# EAGLE design Interface_CoVASPSy_v1re2 (EAGLE 9.6.2)
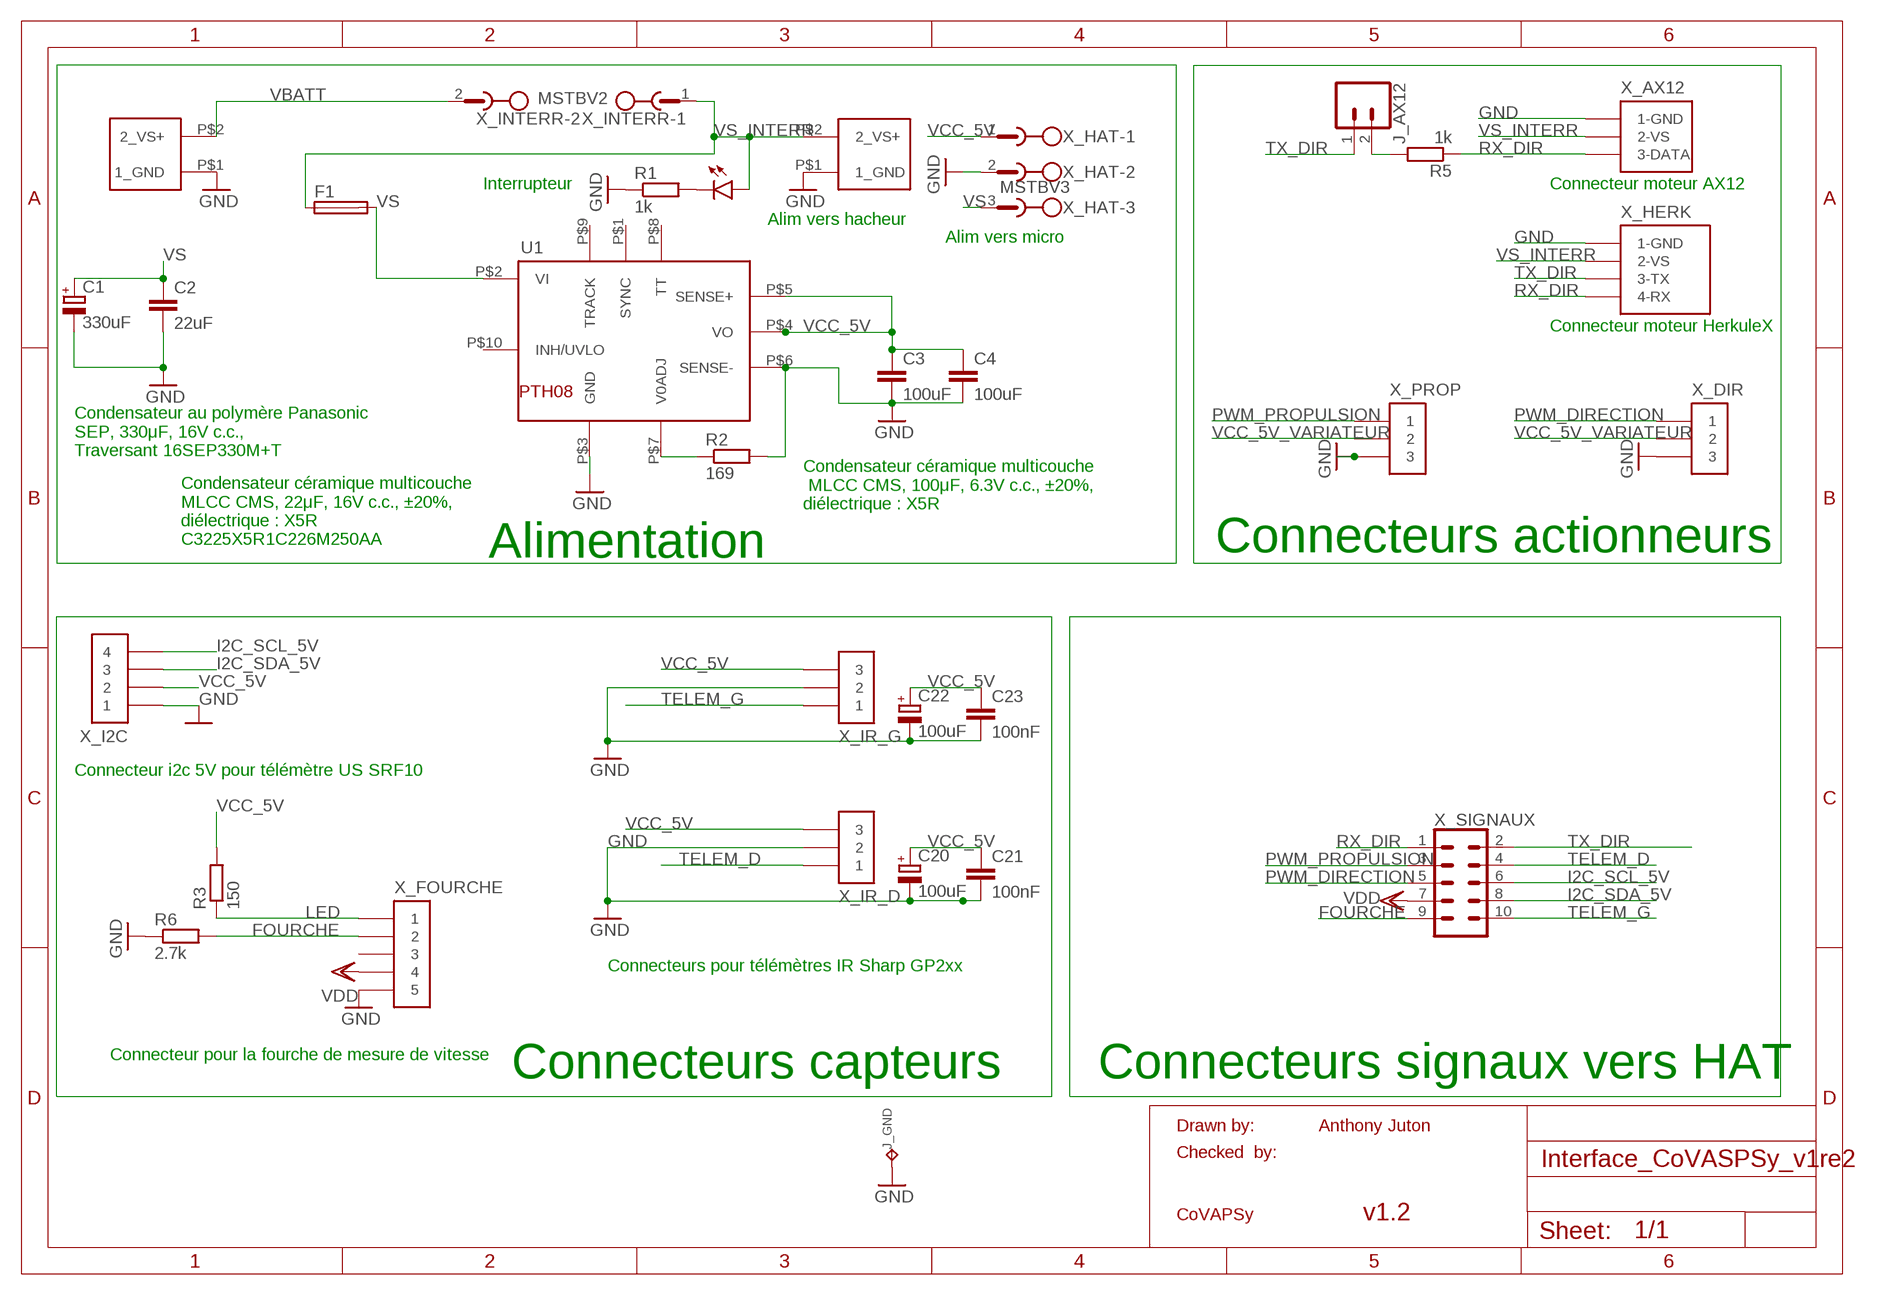
[diagram p0: schematic, sheet 1]

## Parts
C1  330uF  CPOL-EUE3.5-10  [E3,5-10]
C2  22uF  C-EUC1210  [C1210]
C3  100uF  C-EUC1206K  [C1206K]
C4  100uF  C-EUC1206K  [C1206K]
C20  100uF  CPOL-EUA/3216-18W  [A/3216-18W]
C21  100nF  C-EUC1206  [C1206]
C22  100uF  CPOL-EUA/3216-18W  [A/3216-18W]
C23  100nF  C-EUC1206  [C1206]
F1  SH22,5  [SH22,5]
J_AX12  CONN_02  [1X02]
J_GND  COSSE_POIGN  [COSSE_POIGNARD]
LED1  LEDSML1206  [SML1206]
R1  1k  R-EU_M1206  [M1206]
R2  169  R-EU_R0805  [R0805]
R3  150  R-EU_M1206  [M1206]
R5  1k  R-EU_M1206  [M1206]
R6  2.7k  R-EU_M1206  [M1206]
U1  CONV_TI_PTH08  [CONV_TI_PTH8]
X_AX12  MOLEX_AX12  [MOLEX_AX12]
X_BATT  CONN_ALIM_TROU  [CONN_ALIM_TROU]
X_DIR  CAVALIER_3  [CAVALIER_3]
X_FOURCHE  MOLEX_5_DROIT  [MOLEX_5_DROIT]
X_HACH  CONN_ALIM_TROU  [CONN_ALIM_TROU]
X_HAT  MSTBV3  [MSTBV3]
X_HERK  TE_HERKULEX  [TE_HERKULEX]
X_I2C  MOLEX_4_DROIT  [MOLEX_4_DROIT]
X_INTERR  MSTBV2  [MSTBV2]
X_IR_D  JST_3  [JST_3]
X_IR_G  JST_3  [JST_3]
X_PROP  CAVALIER_3  [CAVALIER_3]
X_SIGNAUX  CONN_05X2SHD  [2X5-SHROUDED]

## Nets
FOURCHE: R6.2 X_FOURCHE.P$2 X_SIGNAUX.9
GND: C1.- C2.2 C3.2 C4.2 C20.- C21.2 C22.- C23.2 J_GND.P$1 R1.1 R2.2 R6.1 U1.P$3(GND) U1.P$6(SENSE-) X_AX12.P$1(1-GND) X_BATT.P$1(1_GND) X_DIR.P$3 X_FOURCHE.P$5 X_HACH.P$1(1_GND) X_HAT.2 X_HERK.P$1(1-GND) X_I2C.P$1 X_IR_D.P$2 X_IR_G.P$2 X_PROP.P$3
I2C_SCL_5V: X_I2C.P$4 X_SIGNAUX.6
I2C_SDA_5V: X_I2C.P$3 X_SIGNAUX.8
LED: R3.1 X_FOURCHE.P$1
N$1: LED1.C R1.2
N$4: J_AX12.2 R5.2
N$11: R2.1 U1.P$7(V0ADJ)
PWM_DIRECTION: X_DIR.P$1 X_SIGNAUX.5
PWM_PROPULSION: X_PROP.P$1 X_SIGNAUX.3
RX_DIR: R5.1 X_AX12.P$3(3-DATA) X_HERK.P$4(4-RX) X_SIGNAUX.1
TELEM_D: X_IR_D.P$1 X_SIGNAUX.4
TELEM_G: X_IR_G.P$1 X_SIGNAUX.10
TX_DIR: J_AX12.1 X_HERK.P$3(3-TX) X_SIGNAUX.2
VBATT: X_BATT.P$2(2_VS+) X_INTERR.2
VCC_5V: C3.1 C4.1 C20.+ C21.1 C22.+ C23.1 R3.2 U1.P$4(VO) U1.P$5(SENSE+) X_HAT.1 X_I2C.P$2 X_IR_D.P$3 X_IR_G.P$3
VCC_5V_VARIATEUR: X_DIR.P$2 X_PROP.P$2
VDD: X_FOURCHE.P$4 X_SIGNAUX.7
VS: C1.+ C2.1 F1.2 U1.P$2(VI) X_HAT.3
VS_INTERR: F1.1 LED1.A X_AX12.P$2(2-VS) X_HACH.P$2(2_VS+) X_HERK.P$2(2-VS) X_INTERR.1
Unconnected: U1.P$1(SYNC) U1.P$8(TT) U1.P$9(TRACK) U1.P$10(INH/UVLO) X_FOURCHE.P$3

## Notes on the sheet
- Interrupteur | Connecteur moteur AX12
- Alim vers hacheur
- Alim vers micro
- Connecteur moteur HerkuleX
- Condensateur au polymère Panasonic 
  SEP, 330μF, 16V c.c., 
  Traversant 16SEP330M+T
- Condensateur céramique multicouche
   MLCC CMS, 100μF, 6.3V c.c., ±20%, 
  diélectrique : X5R
- Condensateur céramique multicouche
  MLCC CMS, 22μF, 16V c.c., ±20%,
  diélectrique : X5R
  C3225X5R1C226M250AA
- Alimentation | Connecteurs actionneurs
- Connecteur i2c 5V pour télémètre US SRF10
- Connecteurs pour télémètres IR Sharp GP2xx
- Connecteur pour la fourche de mesure de vitesse
- Connecteurs capteurs | Connecteurs signaux vers HAT
- Drawn by: | Anthony Juton
- Checked  by:
- CoVAPSy | v1.2

## Library data of the parts
C1 = rcl:CPOL-EU: POLARIZED CAPACITOR, European symbol; SPICEPREFIX: C
C2 = rcl:C-EU: CAPACITOR, European symbol; SPICEPREFIX: C
C3 C4 C21 C23 = rcl:C-EU: CAPACITOR, European symbol
C20 C22 = rcl:CPOL-EU: POLARIZED CAPACITOR, European symbol
F1 = fuse:SH22,5: FUSE HOLDER grid 22,5 mm, OGN0031 8201, Schurter (Buerklin); MF: SCHURTER; MPN: 0031.8201; OC_FARNELL: 1162740; OC_NEWARK: 96F8317
J_AX12 = SparkFun-Connectors:CONN_02: Multi connection point. Often used as Generic Header-pin footprint for 0.1 inch spaced/style header connections On any of the 0.1 inch spaced packages, you can populate with these: Break Away Headers - Straight <https://www.sparkfun.com/products/116> (PRT-00116) Break Away Male Headers - Right Angle <https://www.sparkfun.com/products/553> (PRT-00553) Female Headers <https://www.sparkfun.com/products/115> (PRT-00115) Break Away Headers - Machine Pin <https://www.sparkfun.com/products/117> (PRT-00117) Break Away Female Headers - Swiss Machine Pin <https://www.sparkfun.com/products/743> (PRT-00743) For SCREWTERMINALS and SPRING TERMINALS visit here: Screw Terimnals on SparkFun.com <https://www.sparkfun.com/search/results?term=Screw+Terminals> (5mm/3.5mm/2.54mm spacing) This device is also useful as a general connection point to wire up your design to another part of your project. Our various solder wires solder well into these plated through hole pads. Hook-Up Wire - Assortment (Stranded, 22 AWG) <https://www.sparkfun.com/products/11375> (PRT-11375) Hook-Up Wire - Assortment (Solid Core, 22 AWG) <https://www.sparkfun.com/products/11367> (PRT-11367) View the entire wire category on our website here <https://www.sparkfun.com/categories/141> Special notes: Molex polarized connector foot print use with: PRT-08233 with associated crimp pins and housings. 2.54_SCREWTERM for use with PRT-10571. 3.5mm Screw Terminal footprints for PRT-08084 5mm Screw Terminal footprints for use with PRT-08432
J_GND = lib_ens_aj_v1:COSSE_POIGN
LED1 = led:LED: LED OSRAM: - CHIPLED LG R971, LG N971, LY N971, LG Q971, LY Q971, LO R971, LY R971 LH N974, LH R974 LS Q976, LO Q976, LY Q976 LO Q996 - Hyper CHIPLED LW Q18S LB Q993, LB Q99A, LB R99A - SideLED LS A670, LO A670, LY A670, LG A670, LP A670 LB A673, LV A673, LT A673, LW A673 LH A674 LY A675 LS A676, LA A676, LO A676, LY A676, LW A676 LS A679, LY A679, LG A679 - Hyper Micro SIDELED® LS Y876, LA Y876, LO Y876, LY Y876 LT Y87S - SmartLED LW L88C, LW L88S LB L89C, LB L89S, LG L890 LS L89K, LO L89K, LY L89K LS L896, LA L896, LO L896, LY L896 - TOPLED LS T670, LO T670, LY T670, LG T670, LP T670 LSG T670, LSP T670, LSY T670, LOP T670, LYG T670 LG T671, LOG T671, LSG T671 LB T673, LV T673, LT T673, LW T673 LH T674 LS T676, LA T676, LO T676, LY T676, LB T676, LH T676, LSB T676, LW T676 LB T67C, LV T67C, LT T67C, LS T67K, LO T67K, LY T67K, LW E67C LS E67B, LA E67B, LO E67B, LY E67B, LB E67C, LV E67C, LT E67C LW T67C LS T679, LY T679, LG T679 LS T770, LO T770, LY T770, LG T770, LP T770 LB T773, LV T773, LT T773, LW T773 LH T774 LS E675, LA E675, LY E675, LS T675 LS T776, LA T776, LO T776, LY T776, LB T776 LHGB T686 LT T68C, LB T68C - Hyper Mini TOPLED® LB M676 - Mini TOPLED Santana® LG M470 LS M47K, LO M47K, LY M47K Source: http://www.osram.convergy.de LUXEON: - LUMILED® LXK2-PW12-R00, LXK2-PW12-S00, LXK2-PW14-U00, LXK2-PW14-V00 LXK2-PM12-R00, LXK2-PM12-S00, LXK2-PM14-U00 LXK2-PE12-Q00, LXK2-PE12-R00, LXK2-PE12-S00, LXK2-PE14-T00, LXK2-PE14-U00 LXK2-PB12-K00, LXK2-PB12-L00, LXK2-PB12-M00, LXK2-PB14-N00, LXK2-PB14-P00, LXK2-PB14-Q00 LXK2-PR12-L00, LXK2-PR12-M00, LXK2-PR14-Q00, LXK2-PR14-R00 LXK2-PD12-Q00, LXK2-PD12-R00, LXK2-PD12-S00 LXK2-PH12-R00, LXK2-PH12-S00 LXK2-PL12-P00, LXK2-PL12-Q00, LXK2-PL12-R00 Source: www.luxeon.com KINGBRIGHT: KA-3528ASYC Source: www.kingbright.com
R1-R3 R6 = rcl:R-EU_: RESISTOR, European symbol; SPICEPREFIX: R
R5 = rcl:R-EU_: RESISTOR, European symbol
U1 = lib_ens_aj_v1:CONV_TI_PTH08
X_AX12 = lib_ens_aj_v1:MOLEX_AX12
X_BATT X_HACH = lib_ens_aj_v1:CONN_ALIM_TROU
X_DIR X_PROP = lib_ens_aj_v1:CAVALIER_3
X_FOURCHE = lib_ens_aj_v1:MOLEX_5_DROIT
X_HAT = con-phoenix-508:MSTBV3: PHOENIX; MPN: MSTBV 2,5/3-GF-5.08; OC_FARNELL: 1792793; OC_NEWARK: 69R9846
X_HERK = lib_ens_aj_v1:TE_HERKULEX
X_I2C = lib_ens_aj_v1:MOLEX_4_DROIT
X_INTERR = con-phoenix-508:MSTBV2: PHOENIX; MPN: MSTBV 2,5/2-GF-5.08; OC_FARNELL: 1792792; OC_NEWARK: 69R9845
X_IR_D X_IR_G = lib_ens_aj_v1:JST_3
X_SIGNAUX = SparkFun-Connectors:CONN_05X2: Multi connection point. Often used as Generic Header-pin footprint for 0.1 inch spaced/style header connections For AVR SPI programming port, see special device with nice symbol: "AVR_SPI_PROG_5x2.dev" You can populate with any combo of single row headers, but if you'd like an exact match, check these: 2x5 AVR ICSP Male Header <https://www.sparkfun.com/products/778> (PRT-00778) 2x5 Pin Shrouded Header <https://www.sparkfun.com/products/8506> (PRT-08506) On any of the 0.1 inch spaced packages, you can populate with these: Break Away Headers - Straight <https://www.sparkfun.com/products/116> (PRT-00116) Break Away Male Headers - Right Angle <https://www.sparkfun.com/products/553> (PRT-00553) Female Headers <https://www.sparkfun.com/products/115> (PRT-00115) Break Away Headers - Machine Pin <https://www.sparkfun.com/products/117> (PRT-00117) Break Away Female Headers - Swiss Machine Pin <https://www.sparkfun.com/products/743> (PRT-00743) Special note: the shrouded connector mates well with our 5x2 ribbon cables: 2x5 Pin IDC Ribbon Cable <https://www.sparkfun.com/products/8535> (PRT-08535); PROD_ID: CONN-08671; SF_ID: PRT-08506

## Net classes
0 default: width 0.4 mm, drill 0.6 mm, clearance 0.3 mm

## Board
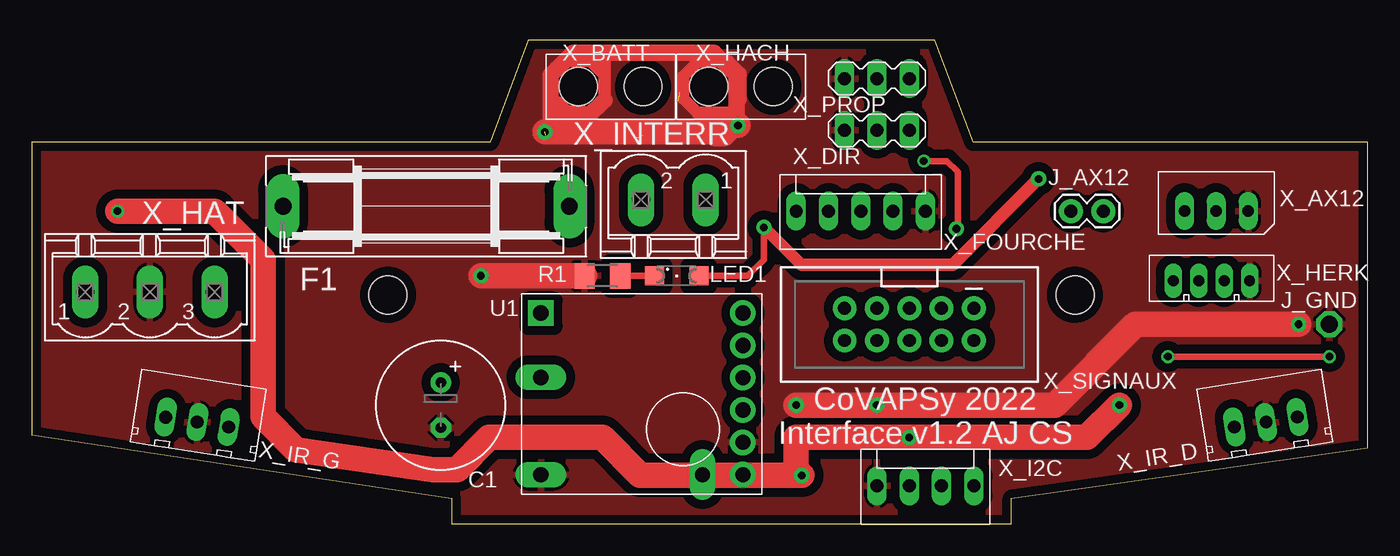
[diagram p1: board, top side]
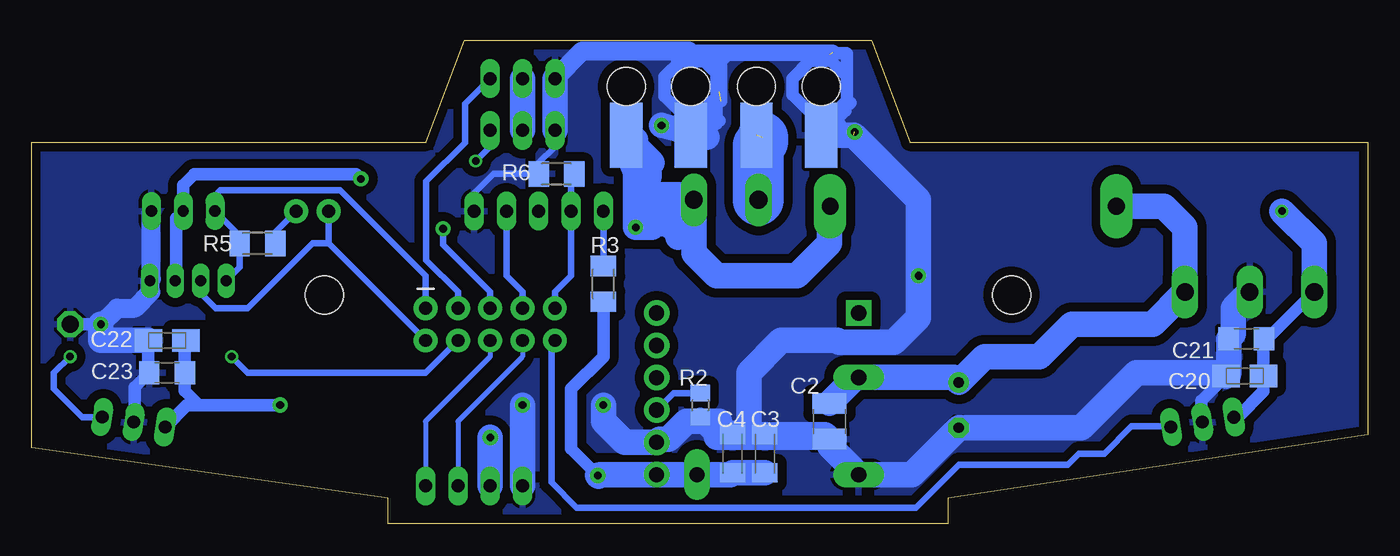
[diagram p2: board, bottom side, seen from below]

Size 105 x 38 mm. Coordinates in mm from the lower left corner, seen from the top.
Outline: 71,38 39,38 36,30 0,30 0,7 33,2 33,0 77,0 77,2 105,6 105,30 74,30 71,38
Copper layers (1*16): Top 0.035mm / dielectric 1.5mm / Bottom 0.035mm
Design rules "default *": minimum track width 6mil, minimum drill 0.35mm, track to track 6mil, track to pad 6mil, pad to pad 6mil, via to via 6mil, smd to smd 6mil, copper to edge 6mil, drill to drill 6mil, minimum pad ring 10mil, minimum via ring 8mil, stop-mask expansion 4mil, vias tented up to drill 0mil, thermal gap 10mil
Holes 3 mm at 82,18 28,18

### Footprints (pad centres in the part's own frame; a part is rotated, then mirrored left to right if it is on the bottom)
E3,5-10 = drill 0.813 pad 1.6: + -1.778,0 | drill 0.813 pad 1.6 octagon: - 1.778,0
C1210 = smd 1.6 x 2.7: 1 -1.4,0; 2 1.4,0
C1206K = smd 1.5 x 2: 1 -1.5,0; 2 1.5,0
A/3216-18W = smd 2.15 x 1.8: + 1.475,0; - -1.475,0
C1206 = smd 1.6 x 1.8: 1 -1.4,0; 2 1.4,0
SH22,5 = drill 1.321 pad 2.54 long: 1 -11.252,0; 2 11.252,0
1X02 = drill 1.016 pad 1.88: 1 0,0; 2 2.54,0
COSSE_POIGNARD = drill 1.35 octagon: P$1 0,0
SML1206 = smd 1.5 x 1.5: A 1.75,0; C -1.75,0
M1206 = smd 1.6 x 2: 1 -1.4,0; 2 1.4,0
R0805 = smd 1.3 x 1.5: 1 -0.95,0; 2 0.95,0
CONV_TI_PTH8 = drill 1.2 pad 2 square: P$1 1.52,14.22 | drill 1.2 pad 2 long: P$2 1.52,9.16; P$3 1.52,1.52; P$4 14.22,1.52 | drill 1.2 pad 2: P$5 17.4,1.52; P$6 17.4,4.06; P$7 17.4,6.6; P$8 17.4,9.14; P$9 17.4,11.68; P$10 17.4,14.22
MOLEX_AX12 = drill 0.9 pad 1.5 long: P$1 -2.5,0; P$2 0,0; P$3 2.5,0
CONN_ALIM_TROU = smd 2.54 x 5.08 bottom: P$1 -2.54,-3.81; P$2 2.54,-3.81 | hole 3: -2.54,0; 2.54,0
CAVALIER_3 = drill 1.016 pad 1.5 long: P$1 -2.54,0; P$2 0,0; P$3 2.54,0
MOLEX_5_DROIT = drill 1.016 pad 1.5 long: P$1 -2.54,0; P$2 0,0; P$3 2.54,0; P$4 5.08,0; P$5 7.62,0
MSTBV3 = drill 1.397 long: 1 -5.08,0; 2 0,0; 3 5.08,0
TE_HERKULEX = drill 0.85 pad 1.3 long: P$1 -3,0; P$2 -1,0; P$3 1,0; P$4 3,0
MOLEX_4_DROIT = drill 1.016 pad 1.5 long: P$1 -2.54,0; P$2 0,0; P$3 2.54,0; P$4 5.08,0
MSTBV2 = drill 1.397 long: 1 -2.54,0; 2 2.54,0
JST_3 = drill 1 pad 1.5 long: P$1 -2.5,0; P$2 0,0 | drill 1.016 pad 1.5 long: P$3 2.5,0
2X5-SHROUDED = drill 1.016 pad 1.88: 1 -1.27,5.08; 2 1.27,5.08; 3 -1.27,2.54; 4 1.27,2.54; 5 -1.27,0; 6 1.27,0; 7 -1.27,-2.54; 8 1.27,-2.54; 9 -1.27,-5.08; 10 1.27,-5.08

### Placement (x,y rotation side)
C1  32.14,9.33 270 top
C2  42.3,8.06 270 bottom
C3  47.38,5.52 90 bottom
C4  49.92,5.52 90 bottom
C20  9.66,11.62 0 bottom
C21  9.53,14.54 180 bottom
C22  94.37,14.41 0 bottom
C23  94.37,11.87 180 bottom
F1  31,24.95 180 top
J_AX12  81.67,24.57 0 top
J_GND  101.99,15.68 0 top
LED1  50.68,19.49 0 top
R1  44.84,19.49 0 top
R2  52.46,9.33 270 bottom
R3  60.08,18.86 270 bottom
R5  87.26,22.03 0 bottom
R6  63.76,27.49 0 bottom
U1  38.49,2.34 0 top
X_AX12  93.1,24.57 180 top
X_BATT  45.5,34.35 0 top
X_DIR  66.43,30.92 180 top
X_FOURCHE  62.62,24.57 0 top
X_HACH  55.74,34.35 0 top
X_HAT  9.28,18.22 0 top
X_HERK  92.72,19.11 180 top
X_I2C  68.97,2.98 0 top
X_INTERR  50.43,25.46 180 top
X_IR_D  97,8 189 top
X_IR_G  13,8 171 top
X_PROP  66.43,34.98 180 top
X_SIGNAUX  68.97,15.68 270 top

### Tracks (layer width: path | path; a pad name or v marks a point on that pad's centre or on a via)
FOURCHE
  Bottom 0.5: R6.2 62.62,27.23 X_FOURCHE.P$2 62.62,19.49 63.89,18.22 X_SIGNAUX.9
GND  (via drill 0.6 pad 1.2)  (3 unrouted)
  Top 1: 55.38,31.43 v55.51,31.3 | 45.01,35.24 45.01,36.99 47.52,36.99 | 45.01,35.24 45.01,33.3 | 41.28,35.75 41.92,36.38 43.86,36.38 45.01,35.24 | 42.11,32.38 42.47,32.02 43.73,32.02 43.38,32.38 42.11,32.38 | 42.11,32.38 41.41,33.08 | 40.78,32.19 41.54,32.19 41.66,32.06 | 55.38,32.32 52.32,32.32 51.2,33.44 51.2,35.13 52.41,36.35 54.74,36.35 55.71,35.39 55.71,33.31 55.24,32.84
  Top 1.3: v40.33,30.8 40.78,31.24 40.78,32.19 40.78,35.24 41.28,35.75 42.55,37.02 53.6,37.02 55.38,35.24 55.38,32.32 55.38,31.43 | 53.86,31.05 53.6,30.79 | 42.51,30.8 43.73,32.02 45.01,33.3
  Top 2: v60.08,9.33 v66.43,9.33 80.4,9.33 86.75,15.68 v99.58,15.68 | v35.31,19.49 R1.1 | v40.33,30.8 42.51,30.8 53.6,30.8 53.6,30.79 53.73,30.67 54.37,30.67 55,31.3 v55.51,31.3
  Bottom 0.5: X_FOURCHE.P$5 70.37,24.7 70.37,25.84 68.72,27.49 R6.1 65.16,28.38 63.89,29.65 X_DIR.P$3
  Bottom 1: C22.- 95.84,11.95 C23.2 96.91,10.73 96.91,8.09 X_IR_D.P$2 | X_BATT.P$1 41.54,31.48 42.27,32.22 41.99,32.22 40.93,33.28 40.93,35.14 | X_BATT.P$1 41.03,31.05 | X_HACH.P$1 50.94,31.68 | 50.96,33.94 50.96,34.56 | X_HACH.P$1 52.78,32.38 | X_HACH.P$1 52.71,32.32 53.98,32.32 55.25,33.59 55.25,35.13 54.03,36.35 52.89,36.35 | 53.35,37.16 53.48,37.03 53.96,36.55 | C20.- 13.09,9.66 13.09,8.09 X_IR_G.P$2 | 40.93,35.14 40.93,36.94 40.98,36.99 50.22,36.99 51.21,36 50.81,36 50.81,33.21 | 51.05,35.37 52.03,36.35 52.89,36.35 | 53.32,36.63 52.6,36.63 52.89,36.35 | C4.2 50.96,8.06 | 43.82,36.38 43.34,36.86 42.3,36.86 | 43.82,36.38 45.21,34.98 45.21,33.7 43.44,31.94 | X_HACH.P$1 51.19,31.42 51.19,35.36 52.21,36.38 | X_BATT.P$1 41.03,32.47 41.03,32.73 40.67,33.1 | 43.82,36.38 42.17,36.38 40.93,35.14 | X_HACH.P$1 51.7,32.04 51.7,33.06 51.5,33.26 | v99.58,15.68 J_GND.P$1
  Bottom 1.3: 53.48,37.03 42.06,37.03
  Bottom 1.5: 53.96,36.55 54.14,36.74 | X_PROP.P$3 61.71,37.16 53.35,37.16 | v99.58,15.68 98.31,16.95 96.91,16.95 95.64,18.22 95.72,18.3 X_HERK.P$1 95.6,19.23 X_AX12.P$1 | R2.2 52.46,8.06 51.19,6.79 50.96,7.02 C4.2 | v40.33,30.8 40.59,30.54
  Bottom 2: X_PROP.P$3 X_DIR.P$3 | X_BATT.P$1 40.59,30.54 | 40.39,30.54 35.31,25.45 v35.31,19.49 35.31,16.18 37.22,14.27 41.55,14.27 41.69,14.41 46.11,14.41 48.65,11.87 48.65,6.79 | C2.2 42.3,6.16 U1.P$3 35.83,3.87 C1.- 22.49,7.55 18.17,11.87 10.99,11.87 10.93,11.82 | C2.2 42.43,6.79 48.65,6.79 | 48.65,6.79 51.19,6.79 51.19,7.11 49.92,7.11 | X_I2C.P$1 v66.43,9.33 | v60.08,9.33 60.08,8.06 58.42,6.41 U1.P$6 55.65,6.64 54.94,6.64 53.52,8.06 50.96,8.06 | v99.58,15.68 99.58,14.41 C22.- | 49.92,7.11 48.97,7.11 48.65,6.79 | C2.2 42.66,7.02 C3.2 | C3.2 49.83,7.02 49.92,7.11 | C4.2 C3.2 | C20.- 10.93,11.82 | 10.93,11.82 C21.2 10.55,14.92 10.55,16.95 X_HAT.2 | v55.51,31.3 51.91,30.38 X_HACH.P$1
  pour Top (isolate 0.7): 0.01,5.52 0.01,30.16 35.95,30.16 35.95,38.03 71.92,38.03 74.05,35.9 74.05,30.16 105.04,30.16 105.04,4.25 91.83,4.25 89.29,1.71 76.59,1.71 76.59,-0.07 33.41,-0.07 33.41,1.71 19.44,1.71 15.63,5.52
  pour Bottom (isolate 0.7): 0.01,5.52 0.01,29.14 1.02,30.16 35.95,30.16 35.95,38.03 74.3,38.03 74.3,30.16 105.04,30.16 105.04,4.25 91.83,4.25 89.29,1.71 76.59,1.71 76.59,-0.07 33.41,-0.07 33.41,1.71 19.44,1.71 15.63,5.52
I2C_SCL_5V
  Bottom 0.4: X_SIGNAUX.6 68.97,13.14 74.05,8.06 X_I2C.P$4
I2C_SDA_5V
  Bottom 0.4: X_SIGNAUX.8 66.43,13.14 71.51,8.06 X_I2C.P$3
LED
  Bottom 0.5: X_FOURCHE.P$1 R3.1
N$1
  Top 0.5: LED1.C R1.2
N$4
  Bottom 0.5: J_AX12.2 85.86,22.92 R5.2
N$11
  Bottom 0.5: U1.P$7 54.55,10.28 R2.1
PWM_DIRECTION  (via drill 0.6, 0.6 pad 1.2)
  Top 0.5: v70.11,28.51 71.94,28.51 72.78,27.67 72.78,23.3 v72.67,23.19
  Bottom 0.5: v70.11,28.51 68.97,29.65 X_DIR.P$1 | v72.67,23.19 72.67,21.92 68.97,18.22 X_SIGNAUX.5
PWM_PROPULSION
  Bottom 0.5: X_PROP.P$1 70.96,33 70.96,29.95 74,26.91 74,20.71 71.51,18.22 X_SIGNAUX.3
RX_DIR
  Bottom 0.5: X_SIGNAUX.1 74.05,19.49 80.78,26.22 90.18,26.22 90.6,25.8 X_AX12.P$3 88.66,22.63 R5.1 88.66,20.17 X_HERK.P$4
TELEM_D  (via drill 0.6)
  Top 0.5: v101.99,13.14 v89.29,13.14
  Bottom 0.5: X_SIGNAUX.4 74.05,11.87 88.02,11.87 v89.29,13.14 | X_IR_D.P$1 101.05,8.39 103.26,10.6 103.26,11.87 v101.99,13.14
TELEM_G
  Bottom 0.5: X_SIGNAUX.10 64.17,14.13 64.17,3.26 62.18,1.27 35.52,1.27 32.13,4.66 27.06,4.66 | 23.56,4.66 27.06,4.66 | 23.56,4.66 23.62,4.65 | 23.56,4.66 22.7,5.52 20.71,5.52 18.57,7.66 15.52,7.66 X_IR_G.P$1 | 23.56,4.66 27.06,4.66 | 27.06,4.66
TX_DIR
  Bottom 0.5: 81.67,23.3 J_AX12.1 81.67,22.03 | 81.67,22.03 X_SIGNAUX.2 | X_HERK.P$3 91.72,18.11 90.56,16.95 88.02,16.95 82.94,22.03 81.67,22.03
VBATT  (1 unrouted)
  Bottom 4: X_INTERR.2 47.89,29.73 47.55,30.06 47.55,30.34
VCC_5V  (via drill 0.6, 0.6 pad 1.2)
  Top 2: v85.48,9.33 82.94,6.79 v68.97,6.79 60.08,6.79 60.08,4.25 v60.52,3.81 47.82,3.81 44.84,6.79 35.95,6.79 33.41,4.25 31.55,4.25 20.76,5.83 18.17,8.41 18.17,20.76 14.36,24.57 v6.74,24.57
  Bottom 1: v85.48,9.33 91.83,9.33 | 91.83,9.33 92.81,9.33 X_IR_D.P$3 | C22.+ 92.97,14.34 C23.1 92.97,10.47 91.83,9.33 | v60.52,3.81 62.62,5.9 62.62,10.6 60.08,13.14 R3.2 | C20.+ 8.01,11.79 | X_HAT.1 7.88,14.54 C21.1 8.19,14.48 C20.+ | C20.+ 8.19,10.42 10.22,8.39 X_IR_G.P$3 10.55,8.37
  Bottom 2: v60.52,3.81 60.46,3.74 60.34,3.87 U1.P$5 U1.P$4 50.08,3.87 C4.1 C3.1 | v68.97,6.79 X_I2C.P$2 | v6.74,24.57 4.2,22.03 X_HAT.1
VCC_5V_VARIATEUR
  Bottom 2: X_PROP.P$2 X_DIR.P$2
VDD
  Bottom 0.5: X_FOURCHE.P$4 67.7,19.49 66.43,18.22 X_SIGNAUX.7
VS
  Bottom 2: C2.1 40.26,11.5 U1.P$2 32.54,11.5 C1.+ 30.11,13.14 25.79,13.14 23.25,15.68 16.9,15.68 X_HAT.3 14.36,23.3 16.01,24.95 F1.2
VS_INTERR  (via drill 0.6 pad 1.2)
  Top 0.5: v57.54,23.3 57.54,20.76 56.27,19.49 LED1.A
  Top 1: v79.13,27.11 72.38,20.36 60.48,20.36 v57.54,23.3
  Bottom 1: v79.13,27.11 79.5,27.48 92.22,27.48 93.1,26.6 X_AX12.P$2 | X_AX12.P$2 93.64,24.03 93.64,19.19 X_HERK.P$2 | X_AX12.P$2 93.1,25.86
  Bottom 1.5: 56.27,28.38 56.27,27.11 57.54,27.11
  Bottom 2: X_INTERR.1 52.97,21.27 51.19,19.49 44.84,19.49 42.3,22.03 42.3,24.9 | 54.98,23.6 54.22,22.84 54.22,22.52 | 42.3,24.9 42.3,25.84 | F1.1 42.3,24.9 | 53.35,25.46 X_INTERR.1 | v57.54,23.3 57.24,23.6 54.98,23.6 | X_HACH.P$2 57.54,30.16 57.54,24.57 | v57.54,23.3 57.54,24.57 | X_HACH.P$2 58.28,29.42 56.27,24.57 | X_INTERR.1 53.35,25.84 56.27,25.84 57.54,24.57 | X_INTERR.1 54.83,23.6 54.98,23.6 | v57.54,23.3 56.27,23.3 55,24.57 | X_HACH.P$2 57.87,29.98 56.27,28.38

### Text on the board
tNames: CoVAPSy 2022 / Interface v1.2 AJ CS